# EAGLE design OLM-env-sensor-REVD (EAGLE 6.4)
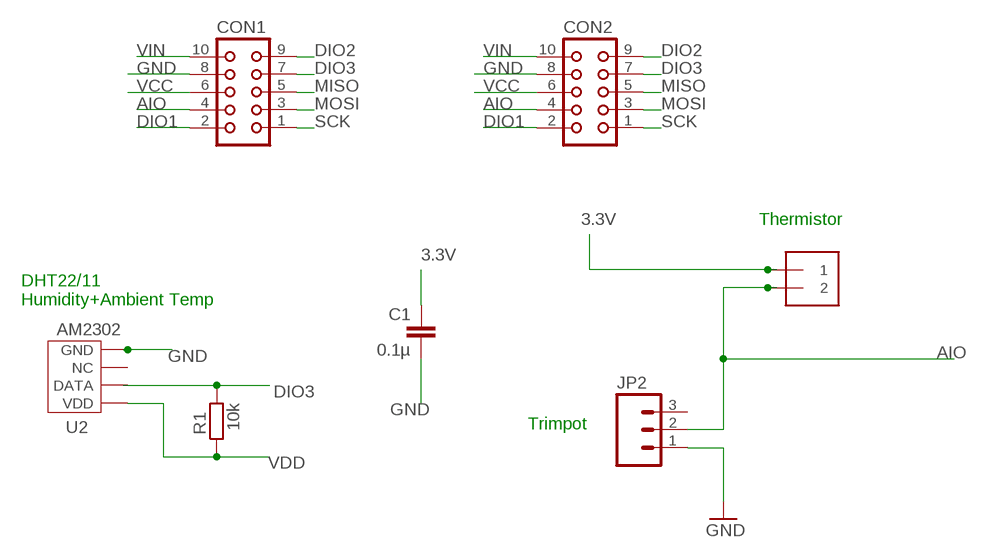
[diagram p0: schematic, sheet 1]

## Parts
C1  0.1µ  C-EU025-024X044  [C025-024X044]
CON1  CON10L  [CON10L]
CON2  CON10L  [CON10L]
J1  1X2-3.5MM  [1X2-3.5MM]
JP2  M03PTH  [1X03]
R1  10k  R-EU_0204/7  [0204/7]
U2  AM2302  [AM2302]

## Nets
3.3V: C1.1 J1.1
AIO: CON1.4 CON2.4 J1.2 JP2.2
DIO1: CON1.2 CON2.2
DIO2: CON1.9 CON2.9
DIO3: CON1.7 CON2.7 R1.2 U2.P$2(DATA)
GND: C1.2 CON1.8 CON2.8 JP2.1 U2.P$4(GND)
MISO: CON1.5 CON2.5
MOSI: CON1.3 CON2.3
SCK: CON1.1 CON2.1
VCC: CON1.6 CON2.6
VDD: R1.1 U2.P$1(VDD)
VIN: CON1.10 CON2.10
Unconnected: JP2.3 U2.P$3(NC)

## Notes on the sheet
- Thermistor
- DHT22/11
  Humidity+Ambient Temp
- Trimpot

## Library data of the parts
C1 = resistor:C-EU: CAPACITOR, European symbol
CON1 CON2 = con-harting:CON10L: CONNECTOR; OC_FARNELL: unknown; OC_NEWARK: unknown
J1 = adafruit:1X2: 3.5mm Terminal block http://www.ladyada.net/library/pcb/eaglelibrary.html
JP2 = SparkFun-Connectors:M03: Header 3 Standard 3-pin 0.1" header. Use with straight break away headers (SKU : PRT-00116), right angle break away headers (PRT-00553), swiss pins (PRT-00743), machine pins (PRT-00117), and female headers (PRT-00115). Molex polarized connector foot print use with SKU : PRT-08232 with associated crimp pins and housings.
R1 = rcl:R-EU_: RESISTOR, European symbol
U2 = sensor:AM2302

## Net classes
0 default: width 0.254 mm, drill 0.254 mm, clearance 0.254 mm
1 power: width 0.813 mm, drill 0.254 mm, clearance 0.254 mm

## Board
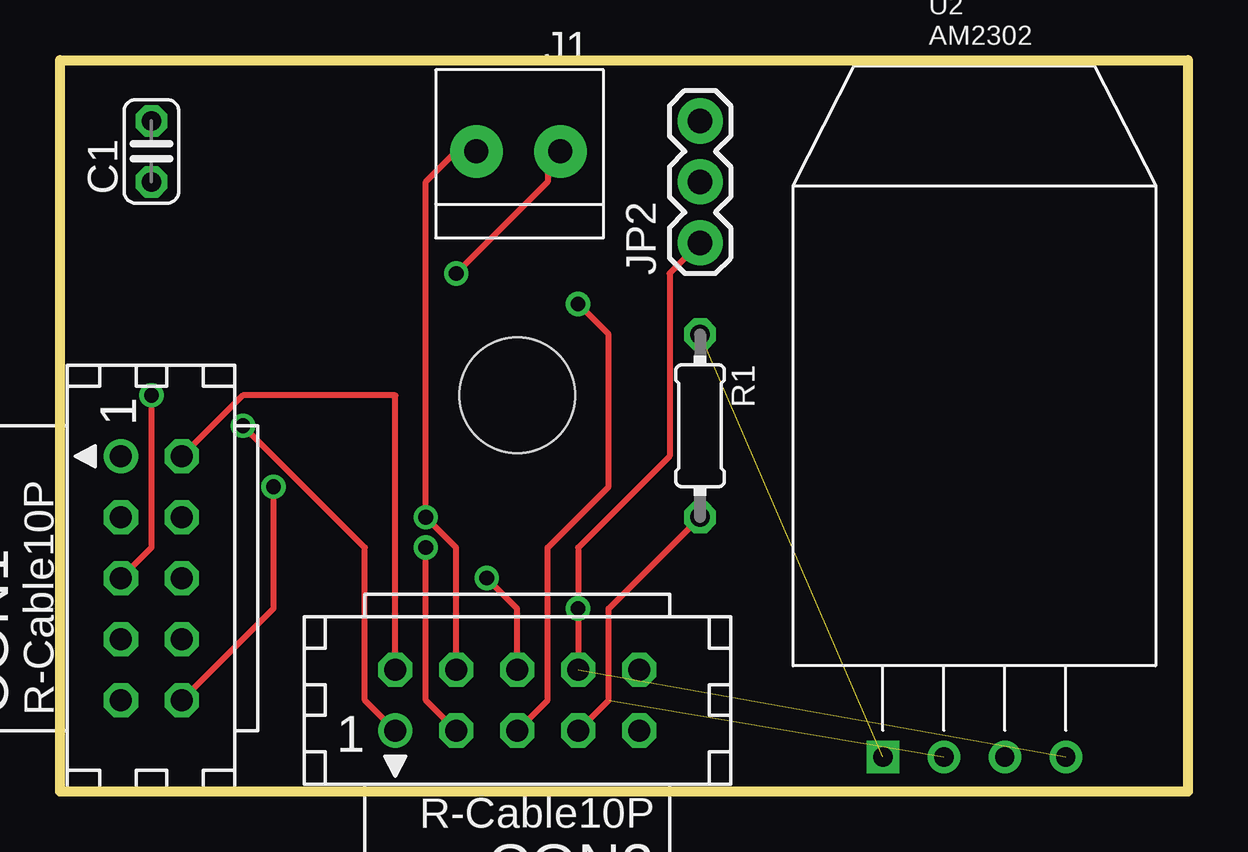
[diagram p1: board, top side]
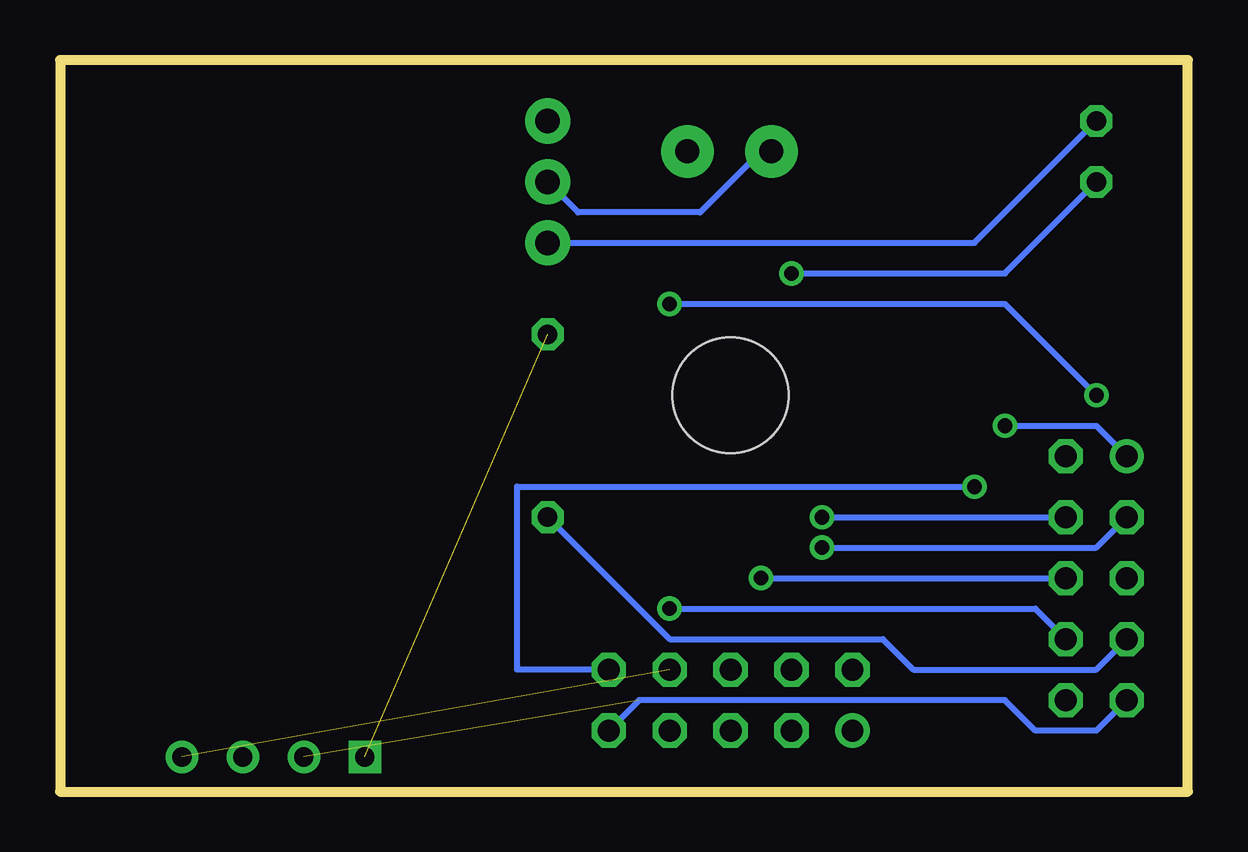
[diagram p2: board, bottom side, seen from below]

Size 46.99 x 30.48 mm. Coordinates in mm from the lower left corner, seen from the top.
Outline: 0,0 0,30.48 46.99,30.48 46.99,0 0,0
Copper layers (1*16): Top 0.035mm / dielectric 1.5mm / Bottom 0.035mm
Design rules "default": minimum track width 10mil, minimum drill 24mil, track to track 8mil, track to pad 8mil, pad to pad 8mil, via to via 8mil, smd to smd 8mil, copper to edge 40mil, drill to drill 8mil, minimum pad ring 10mil, minimum via ring 8mil, stop-mask expansion 4mil, vias tented up to drill 0mil, thermal gap 10mil
Holes 4.83 mm at 19.05,16.51

### Footprints (pad centres in the part's own frame; a part is rotated, then mirrored left to right if it is on the bottom)
C025-024X044 = drill 0.813 octagon: 1 -1.27,0; 2 1.27,0
CON10L = drill 0.914: 1 5.08,1.27 | drill 0.914 octagon: 2 5.08,-1.27; 3 2.54,1.27; 4 2.54,-1.27; 5 0,1.27; 6 0,-1.27; 7 -2.54,1.27; 8 -2.54,-1.27; 9 -5.08,1.27; 10 -5.08,-1.27
1X2-3.5MM = drill 1 pad 2.184: 1 1.8,0; 2 -1.7,0
1X03 = drill 1.016 pad 1.88: 1 0,0; 2 2.54,0; 3 5.08,0
0204/7 = drill 0.813 octagon: 1 -3.81,0; 2 3.81,0
AM2302 = drill 0.8 pad 1.35 square: P$1 -3.81,-13.8 | drill 0.8 pad 1.35: P$2 -1.27,-13.8; P$3 1.27,-13.8; P$4 3.81,-13.8

### Placement (x,y rotation side)
C1  3.81,26.67 90 top
CON1  3.81,8.89 90 top
CON2  19.05,3.81 180 top
J1  19.05,26.67 0 top
JP2  26.67,22.86 90 top
R1  26.67,15.24 270 top
U2  38.1,15.24 0 top

### Tracks (layer width: path | path; a pad name or v marks a point on that pad's centre or on a via)
3.3V  (via drill 0.61)
  Top 0.254: v16.51,21.59 20.32,25.4 20.32,26.67 J1.1
  Bottom 0.254: C1.1 7.62,21.59 v16.51,21.59
AIO  (via drill 0.61)
  Top 0.254: CON2.4 16.51,10.16 v15.24,11.43 15.24,25.4 16.51,26.67 J1.2
  Bottom 0.254: JP2.2 25.4,24.13 20.32,24.13 17.78,26.67 J1.2 | v15.24,11.43 CON1.4
DIO1
  Top 0.254: CON1.2 7.62,16.51 13.97,16.51 CON2.2
DIO2
  Bottom 0.254: CON2.9 22.86,3.81 7.62,3.81 6.35,2.54 3.81,2.54 CON1.9
DIO3  (1 unrouted)
  Top 0.254: R1.2 22.86,7.62 22.86,3.81 CON2.7
  Bottom 0.254: CON1.7 3.81,5.08 11.43,5.08 12.7,6.35 21.59,6.35 R1.2
GND  (via drill 0.61)  (1 unrouted)
  Top 0.254: CON2.8 v21.59,7.62 21.59,10.16 25.4,13.97 25.4,21.59 JP2.1
  Bottom 0.254: C1.2 8.89,22.86 JP2.1 | CON1.8 6.35,7.62 v21.59,7.62
MISO  (via drill 0.61)
  Top 0.254: CON1.5 3.81,10.16 v3.81,16.51 | v21.59,20.32 22.86,19.05 22.86,12.7 20.32,10.16 20.32,3.81 CON2.5
  Bottom 0.254: v3.81,16.51 7.62,20.32 v21.59,20.32
MOSI  (via drill 0.61)
  Top 0.254: v15.24,10.16 15.24,3.81 CON2.3
  Bottom 0.254: CON1.3 3.81,10.16 v15.24,10.16
SCK  (via drill 0.61)
  Top 0.254: v7.62,15.24 12.7,10.16 12.7,3.81 CON2.1
  Bottom 0.254: CON1.1 3.81,15.24 v7.62,15.24
VCC  (via drill 0.61)
  Top 0.254: v17.78,8.89 19.05,7.62 CON2.6
  Bottom 0.254: v17.78,8.89 CON1.6
VDD  (1 unrouted)
VIN  (via drill 0.61)
  Top 0.254: CON1.10 8.89,7.62 v8.89,12.7
  Bottom 0.254: v8.89,12.7 27.94,12.7 27.94,5.08 CON2.10